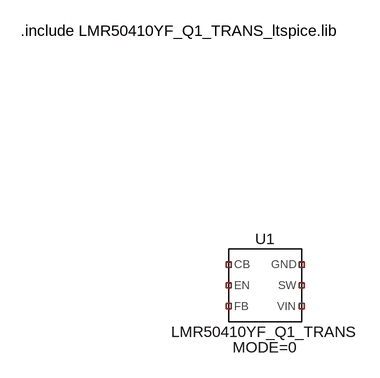
[diagram p0: schematic Buck3v3.asc]
Buck3v3.asc, the LTspice schematic file:
Version 4.1
SHEET 1 880 680
SYMBOL LMR50410YF_Q1_TRANS 224 400 R0
SYMATTR InstName U1
TEXT -144 8 Left 2 !.include LMR50410YF_Q1_TRANS_ltspice.lib

The netlist it stands for:
* Buck3v3.asc
X§U1 NC_01 NC_02 NC_03 NC_04 NC_05 NC_06 LMR50410YF_Q1_TRANS MODE=0  ; pins CB EN FB GND SW VIN
.include LMR50410YF_Q1_TRANS_ltspice.lib
.lib LMR50410YF_Q1_TRANS_ltspice.lib
.backanno
.end